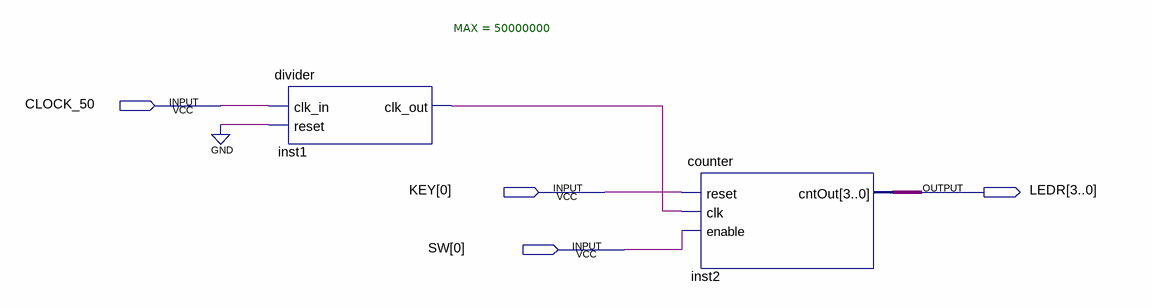
[diagram p0: schematic sheet]
// Quartus schematic Block1.bdf as structural Verilog: 2 symbols, 4 pins
module Block1 (
  input  CLOCK_50,
  input  [0:0] KEY,
  input  [0:0] SW,
  output [3:0] LEDR
);

  wire inst1_clk_out;

  divider #(.MAX(50000000)) inst1 (.clk_in(CLOCK_50), .reset(1'b0), .clk_out(inst1_clk_out));
  counter inst2 (.reset(KEY[0]), .clk(inst1_clk_out), .enable(SW[0]), .cntOut(LEDR));
endmodule
